# Altium schematic sheet 08 usb hub.SchDoc
size A3; SheetNumber: 12; SheetTotal: 16
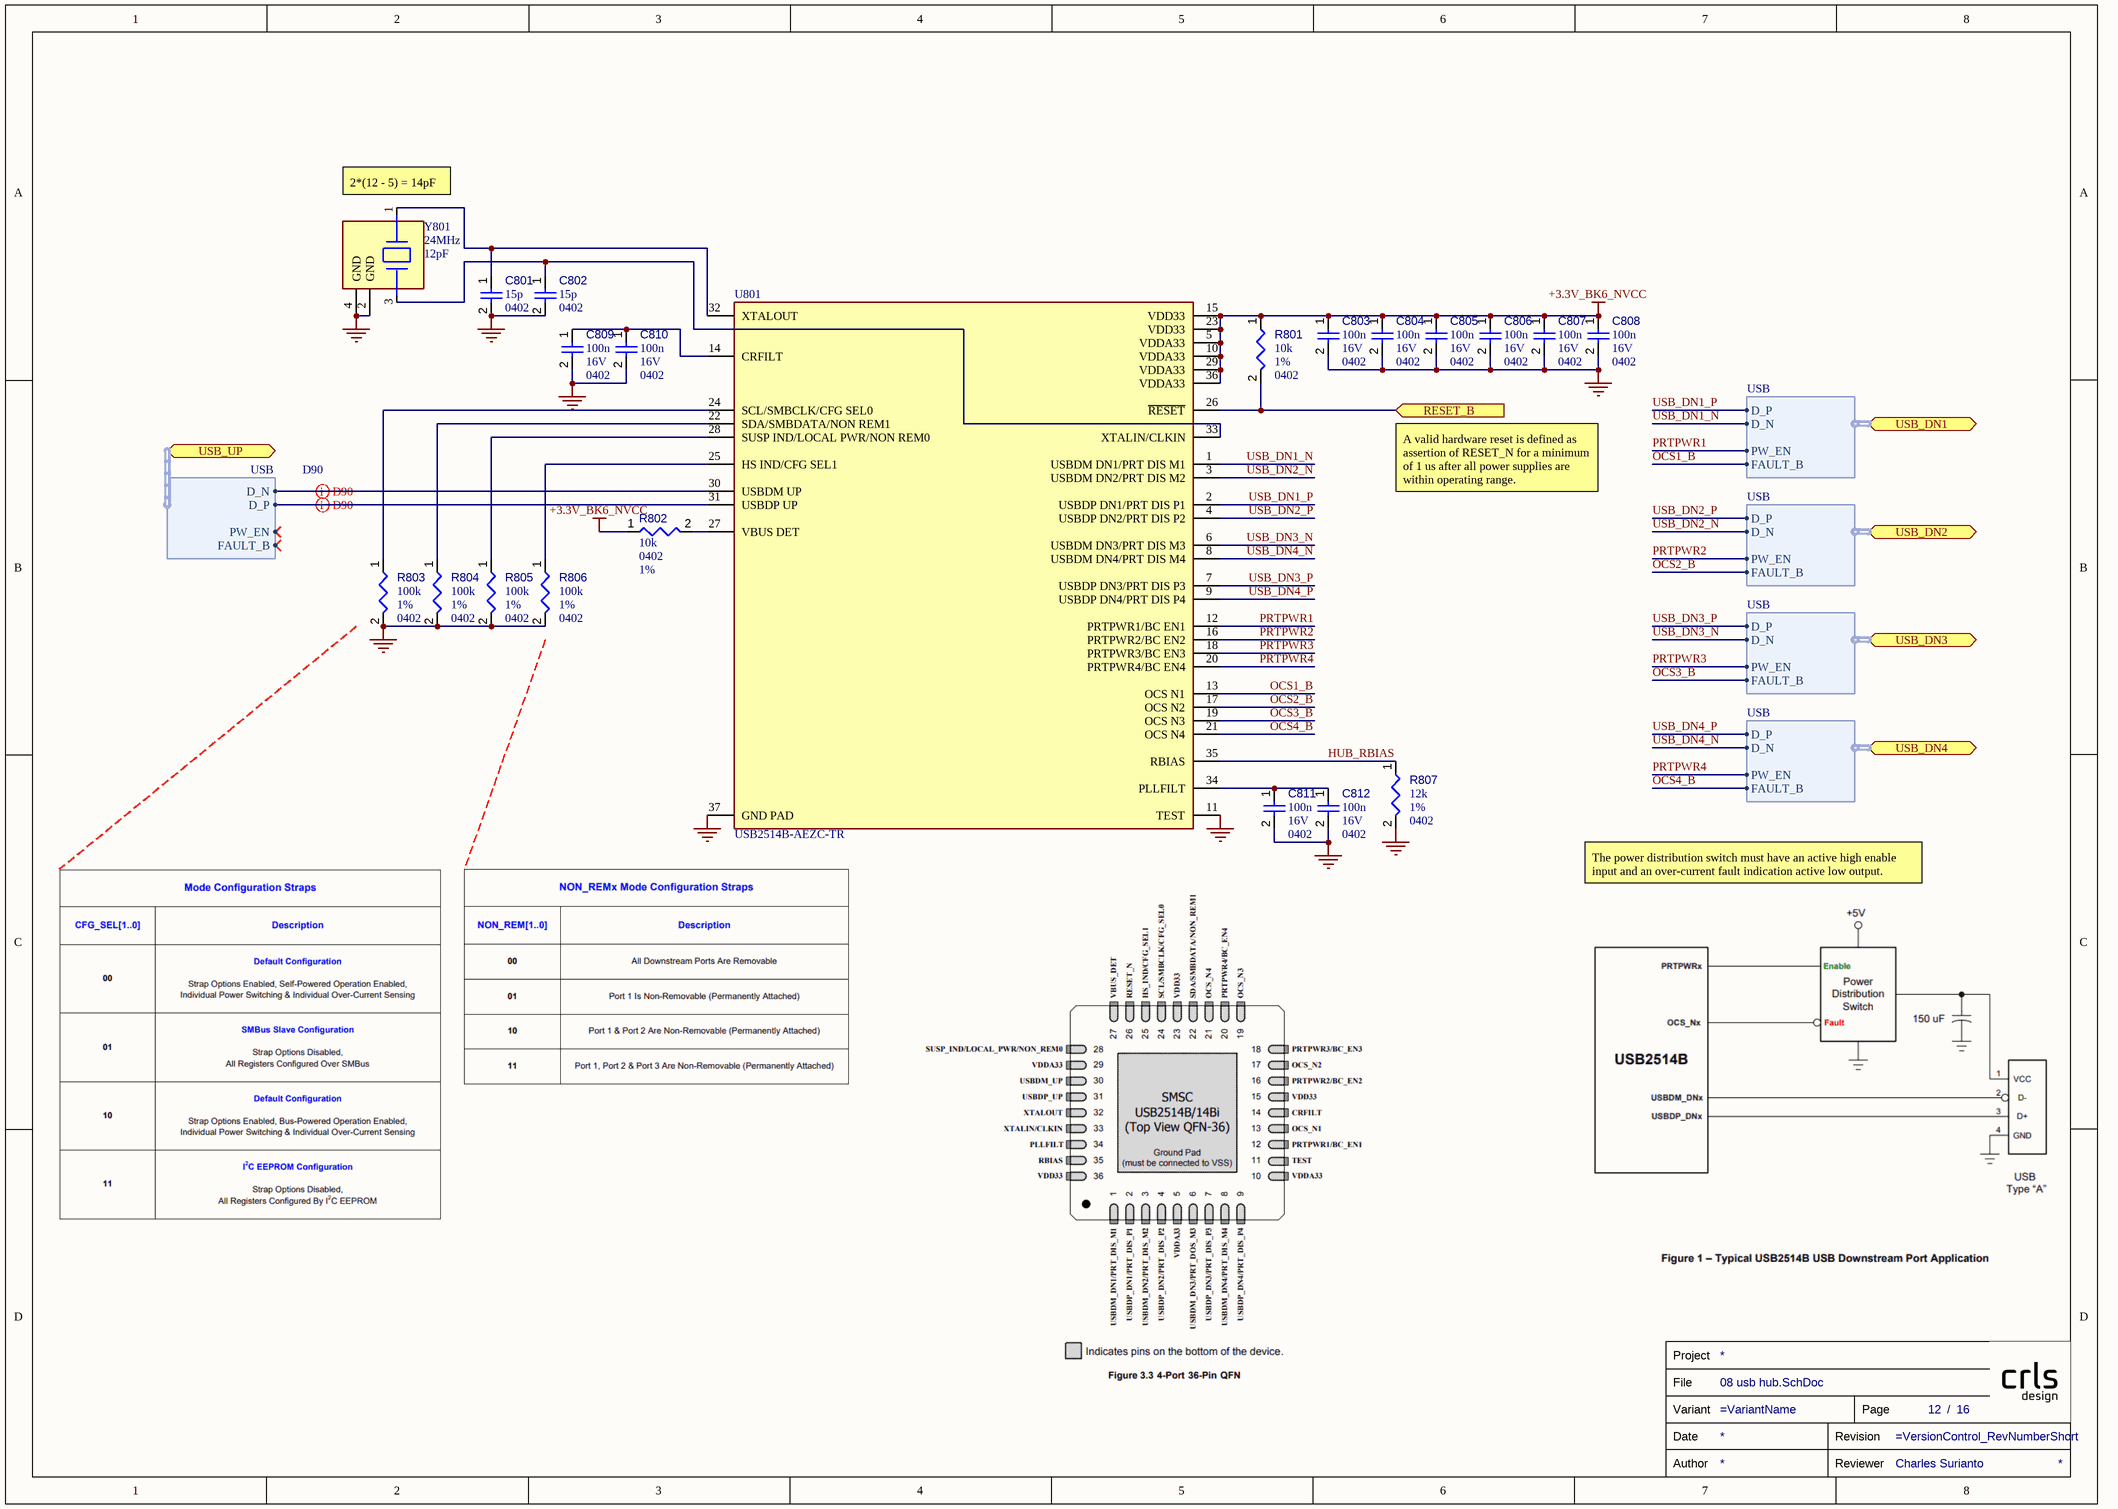
[diagram p0: 08 usb hub.SchDoc]

## Parts
C801  value 15p  Case/Package: 0402  [CAPC0402(1005)60_L]  (hidden comment: Capacitors,0402,15p)
C802  value 15p  Case/Package: 0402  [CAPC0402(1005)60_L]  (hidden comment: Capacitors,0402,15p)
C803  value 100n  Case/Package: 0402  Voltage Rating: 16V  [CAPC0402(1005)60_L]  (hidden comment: Capacitors,0402,100n,16V)
C804  value 100n  Case/Package: 0402  Voltage Rating: 16V  [CAPC0402(1005)60_L]  (hidden comment: Capacitors,0402,100n,16V)
C805  value 100n  Case/Package: 0402  Voltage Rating: 16V  [CAPC0402(1005)60_L]  (hidden comment: Capacitors,0402,100n,16V)
C806  value 100n  Case/Package: 0402  Voltage Rating: 16V  [CAPC0402(1005)60_L]  (hidden comment: Capacitors,0402,100n,16V)
C807  value 100n  Case/Package: 0402  Voltage Rating: 16V  [CAPC0402(1005)60_L]  (hidden comment: Capacitors,0402,100n,16V)
C808  value 100n  Case/Package: 0402  Voltage Rating: 16V  [CAPC0402(1005)60_L]  (hidden comment: Capacitors,0402,100n,16V)
C809  value 100n  Case/Package: 0402  Voltage Rating: 16V  [CAPC0402(1005)60_L]  (hidden comment: Capacitors,0402,100n,16V)
C810  value 100n  Case/Package: 0402  Voltage Rating: 16V  [CAPC0402(1005)60_L]  (hidden comment: Capacitors,0402,100n,16V)
C811  value 100n  Case/Package: 0402  Voltage Rating: 16V  [CAPC0402(1005)60_L]  (hidden comment: Capacitors,0402,100n,16V)
C812  value 100n  Case/Package: 0402  Voltage Rating: 16V  [CAPC0402(1005)60_L]  (hidden comment: Capacitors,0402,100n,16V)
R801  value 10k  Case/Package: 0402  Tolerance: 1%  [RESC0402(1005)_L]  (hidden comment: Resistors,0402,1%,10k)
R802  value 10k  Case/Package: 0402  Tolerance: 1%  [RESC0402(1005)_L]  (hidden comment: Resistors,0402,1%,10k)
R803  value 100k  Case/Package: 0402  Tolerance: 1%  [RESC0402(1005)_L]  (hidden comment: Resistors,0402,1%,100k)
R804  value 100k  Case/Package: 0402  Tolerance: 1%  [RESC0402(1005)_L]  (hidden comment: Resistors,0402,1%,100k)
R805  value 100k  Case/Package: 0402  Tolerance: 1%  [RESC0402(1005)_L]  (hidden comment: Resistors,0402,1%,100k)
R806  value 100k  Case/Package: 0402  Tolerance: 1%  [RESC0402(1005)_L]  (hidden comment: Resistors,0402,1%,100k)
R807  value 12k  Case/Package: 0402  Tolerance: 1%  [RESC0402(1005)_L]  (hidden comment: Resistors,0402,1%,12k)
TB?  Reviewer: Charles Surianto  (hidden comment: TITLE_BLOCK)  (graphical)
U801  USB2514B-AEZC-TR  [FP-USB2514B-AEZC-TR-MFG]
Y801  Load Capacitance: 12pF  Frequency: 24MHz  [FP-TSX-3225-MFG]  (hidden comment: TSX-3225 24.0000MF20G-AC3)

## Ports
RESET_B (in), USB_DN1 (bidir, harness USB), USB_DN2 (bidir, harness USB), USB_DN3 (bidir, harness USB), USB_DN4 (bidir, harness USB), USB_UP (bidir, harness USB)

## Harnesses
USB: D_P, D_N, PW_EN, FAULT_B

## Nets
+3.3V_BK6_NVCC: C803.1 C804.1 C805.1 C806.1 C807.1 C808.1 R801.1 R802.1 U801.5(VDDA33) U801.10(VDDA33) U801.15(VDD33) U801.23(VDD33) U801.29(VDDA33) U801.36(VDDA33)
GND: C801.2 C802.2 C803.2 C804.2 C805.2 C806.2 C807.2 C808.2 C809.2 C810.2 C811.2 C812.2 R803.2 R804.2 R805.2 R806.2 R807.2 U801.11(TEST) U801.37(GND_PAD) Y801.2(GND) Y801.4(GND)
HUB_RBIAS: R807.1 U801.35(RBIAS)
OCS1_B: U801.13(OCS_N1) ; port USB_DN1.FAULT_B
OCS2_B: U801.17(OCS_N2) ; port USB_DN2.FAULT_B
OCS3_B: U801.19(OCS_N3) ; port USB_DN3.FAULT_B
OCS4_B: U801.21(OCS_N4) ; port USB_DN4.FAULT_B
PRTPWR1: U801.12(PRTPWR1/BC_EN1) ; port USB_DN1.PW_EN
PRTPWR2: U801.16(PRTPWR2/BC_EN2) ; port USB_DN2.PW_EN
PRTPWR3: U801.18(PRTPWR3/BC_EN3) ; port USB_DN3.PW_EN
PRTPWR4: U801.20(PRTPWR4/BC_EN4) ; port USB_DN4.PW_EN
RESET_B: R801.2 U801.26(~{RESET}) ; port RESET_B
USB_DN1_N: U801.1(USBDM_DN1/PRT_DIS_M1) ; port USB_DN1.D_N
USB_DN1_P: U801.2(USBDP_DN1/PRT_DIS_P1) ; port USB_DN1.D_P
USB_DN2_N: U801.3(USBDM_DN2/PRT_DIS_M2) ; port USB_DN2.D_N
USB_DN2_P: U801.4(USBDP_DN2/PRT_DIS_P2) ; port USB_DN2.D_P
USB_DN3_N: U801.6(USBDM_DN3/PRT_DIS_M3) ; port USB_DN3.D_N
USB_DN3_P: U801.7(USBDP_DN3/PRT_DIS_P3) ; port USB_DN3.D_P
USB_DN4_N: U801.8(USBDM_DN4/PRT_DIS_M4) ; port USB_DN4.D_N
USB_DN4_P: U801.9(USBDP_DN4/PRT_DIS_P4) ; port USB_DN4.D_P
NetC801_1: C801.1 U801.32(XTALOUT) Y801.1
NetC802_1: C802.1 U801.33(XTALIN/CLKIN) Y801.3
NetC809_1: C809.1 C810.1 U801.14(CRFILT)
NetC811_1: C811.1 C812.1 U801.34(PLLFILT)
NetR802_2: R802.2 U801.27(VBUS_DET)
NetR803_1: R803.1 U801.24(SCL/SMBCLK/CFG_SEL0)
NetR804_1: R804.1 U801.22(SDA/SMBDATA/NON_REM1)
NetR805_1: R805.1 U801.28(SUSP_IND/LOCAL_PWR/NON_REM0)
NetR806_1: R806.1 U801.25(HS_IND/CFG_SEL1)
NetU801_30: U801.30(USBDM_UP) ; port USB_UP.D_N
NetU801_31: U801.31(USBDP_UP) ; port USB_UP.D_P

## Layout directives
differential pair; differential pair class D90: NetU801_30, NetU801_31

## Notes on the sheet
- (near Y801) 2*(12 - 5) = 14pF
- A valid hardware reset is defined as assertion of RESET_N for a minimum of 1 us after all power supplies are within operating range.
- The power distribution switch must have an active high enable input and an over-current fault indication active low output.
- (in symbol TITLE_BLOCK) Project; File; Variant; Page; /; Date; Revision; Author; Reviewer

## Library data of the parts
C801-C812 = Capacitors: Capacitor; Component Type: Capacitors
R801-R807 = Resistors: Resistor; Component Type: Resistors
U801 = CMP-06284-000026-1: IC CONTROLLER USB 36QFN; Operating Supply Voltage: 3.3V; Operating Supply Current: 70mA; Number of Ports: 4; Lead Free: Lead Free; RoHS Compliant: Yes; Series: -; Case/Package: QFN; Interface: USB; Max Operating Temperature: 85°C; Packaging: Tape and Reel; Min Operating Temperature: 0°C; Package Quantity: 3000; Radiation Hardening: No
Y801 = CMP-36405-000018-1: CRYSTAL 24.0000MHZ 9PF SMD; ESR (Equivalent Series Resistance): 40R; Frequency Stability: 20ppm; Tolerance: 10ppm; Drive Level: 200uW; Min Operating Temperature: -40°C; RoHS Compliant: Yes; Width: 2.5mm; Max Operating Temperature: 105°C; Package Quantity: 250; Mount: Surface Mount; Lead Free: Lead Free; Height: 0.024inch; Depth: 2.5mm; Packaging: Tape and Reel; Series: TSX-3225; Weight: 0.000564oz; Number of Pins: 4; Termination: SMD/SMT; Case/Package: SMD/SMT; Length: 3.2mm; Frequency Tolerance: 10ppm
TB? = TITLE_BLOCK: Review Date: *